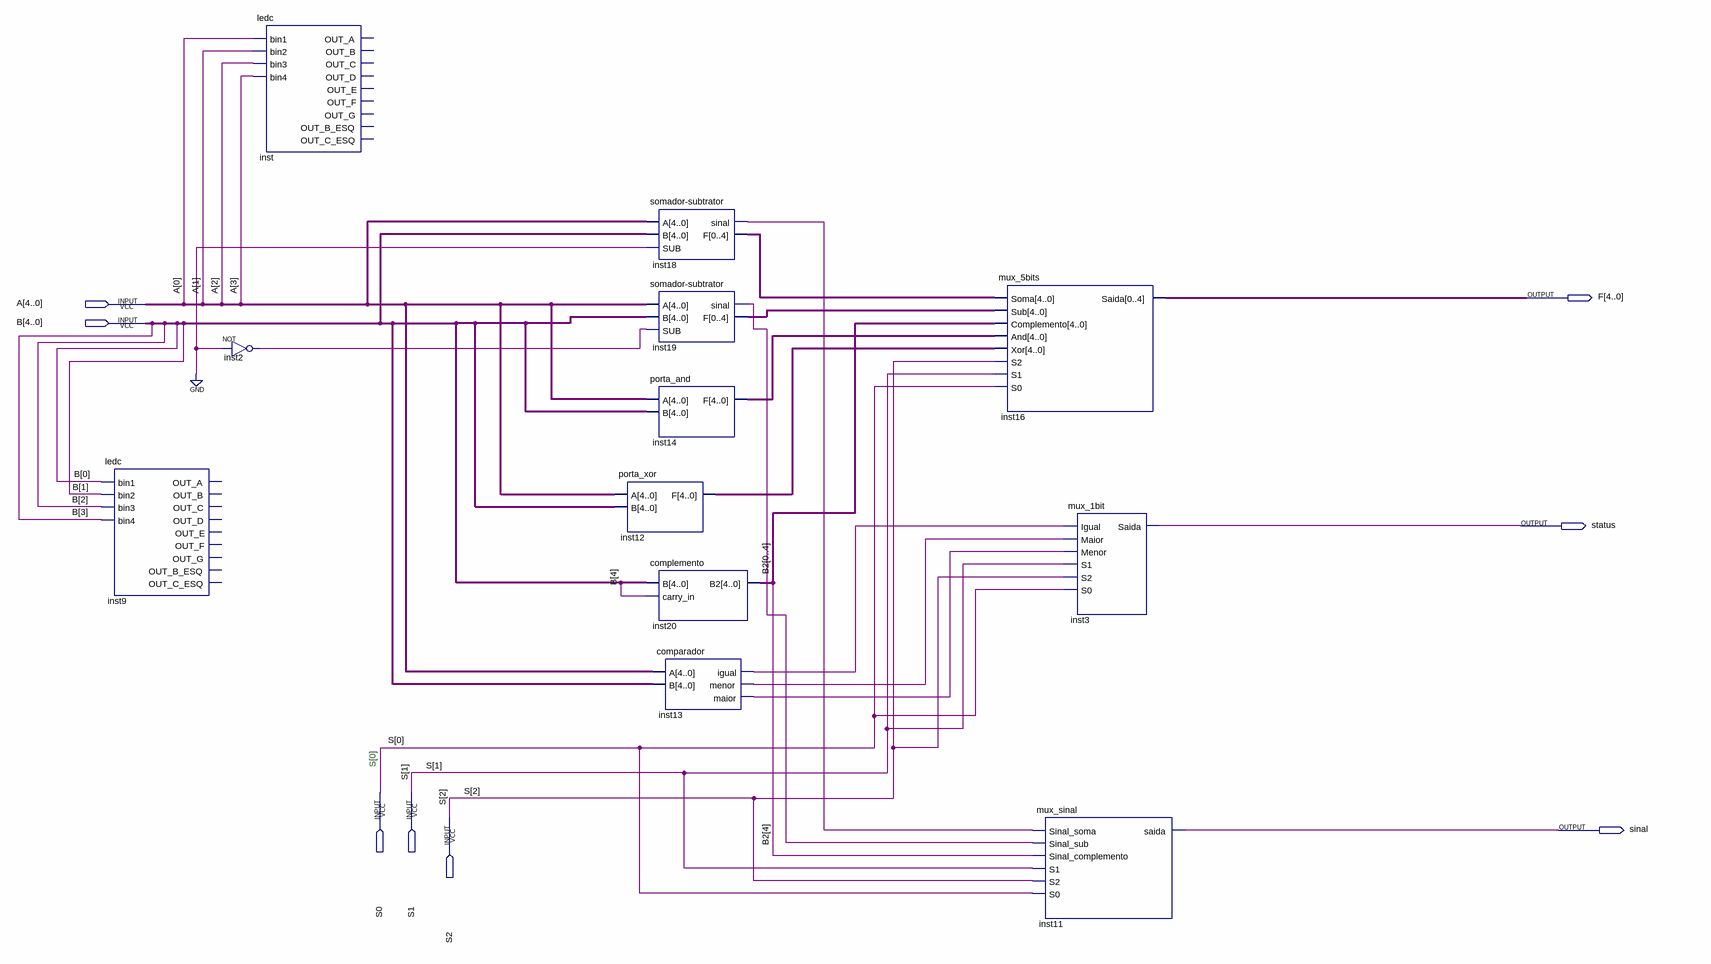
[diagram p0: schematic sheet]
// Quartus schematic ULA.bdf as structural Verilog: 12 symbols, 8 pins
module ULA (
  input  [4:0] A,
  input  [4:0] B,
  input  S0,
  input  S1,
  input  S2,
  output [4:0] F,
  output status,
  output sinal
);

  wire inst2_out, inst13_igual, inst13_maior, inst13_menor, inst18_sinal, inst19_sinal;
  wire [4:0] B2, inst12_f, inst14_f, inst18_f, inst19_f;

  ledc inst9 (
    .bin1(B[0]), .bin2(B[1]), .bin3(B[2]), .bin4(B[3]));  // open: OUT_A, OUT_B, OUT_C, OUT_D, OUT_E, OUT_F, OUT_G, OUT_B_ESQ, OUT_C_ESQ
  not inst2 (inst2_out, 1'b0);
  ledc inst (
    .bin1(A[0]), .bin2(A[1]), .bin3(A[2]), .bin4(A[3]));  // open: OUT_A, OUT_B, OUT_C, OUT_D, OUT_E, OUT_F, OUT_G, OUT_B_ESQ, OUT_C_ESQ
  porta_xor inst12 (.A(A), .B(B), .F(inst12_f));
  \somador-subtrator  inst18 (.A(A), .B(B), .SUB(1'b0), .sinal(inst18_sinal), .F(inst18_f));
  \somador-subtrator  inst19 (.A(A), .B(B), .SUB(inst2_out), .sinal(inst19_sinal), .F(inst19_f));
  porta_and inst14 (.A(A), .B(B), .F(inst14_f));
  complemento inst20 (.B(B), .carry_in(B[4]), .B2({B2[0], B2[1], B2[2], B2[3], B2[4]}));
  comparador inst13 (.A(A), .B(B), .igual(inst13_igual), .menor(inst13_menor), .maior(inst13_maior));
  mux_5bits inst16 (
    .Soma(inst18_f), .Sub(inst19_f), .Complemento({B2[0], B2[1], B2[2], B2[3], B2[4]}), .And(inst14_f),
    .Xor(inst12_f), .S2(S2), .S1(S1), .S0(S0), .Saida(F));
  mux_sinal inst11 (
    .Sinal_soma(inst18_sinal), .Sinal_sub(inst19_sinal), .Sinal_complemento(B2[4]), .S1(S1), .S2(S2),
    .S0(S0), .saida(sinal));
  mux_1bit inst3 (
    .Igual(inst13_igual), .Maior(inst13_menor), .Menor(inst13_maior), .S1(S1), .S2(S2), .S0(S0),
    .Saida(status));

  // Notes on the sheet:
  //   S[0]
endmodule
